# EAGLE design Busboard v10 (EAGLE 7.3.0)
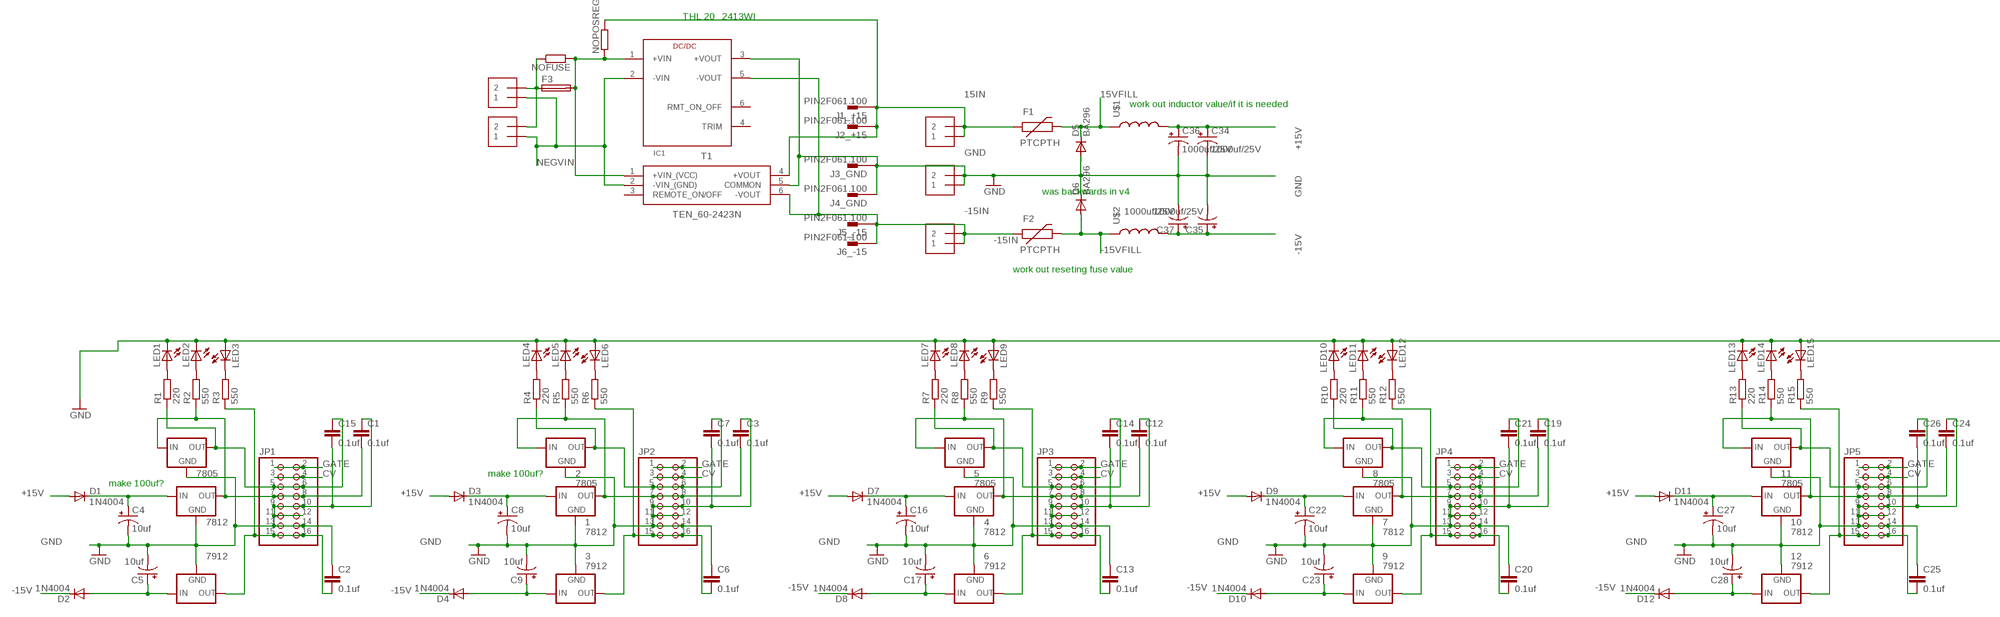
[diagram p0: schematic, sheet 1, part 1 of 2]
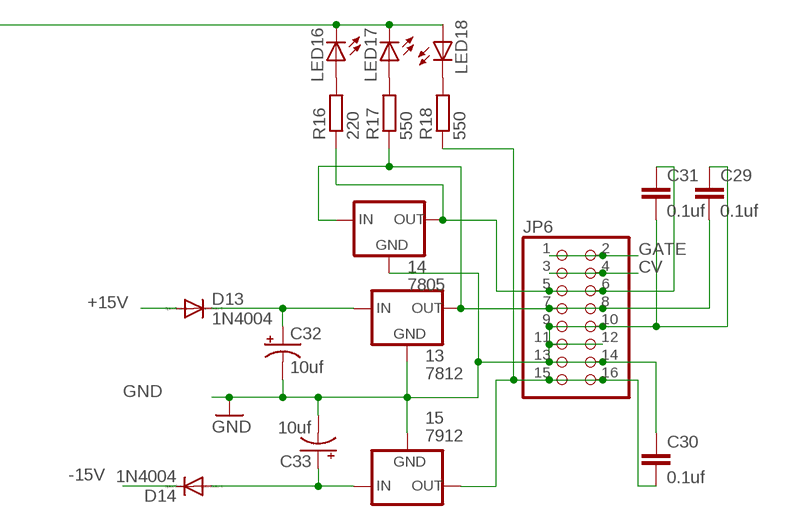
[diagram p1: schematic, sheet 1, part 2 of 2]

## Parts
1  7812  78MXXS  [78MXXS]
2  7805  78MXXS  [78MXXS]
3  7912  79XXS  [79XXS]
4  7812  78MXXS  [78MXXS]
5  7805  78MXXS  [78MXXS]
6  7912  79XXS  [79XXS]
7  7812  78MXXS  [78MXXS]
8  7805  78MXXS  [78MXXS]
9  7912  79XXS  [79XXS]
10  7812  78MXXS  [78MXXS]
11  7805  78MXXS  [78MXXS]
12  7912  79XXS  [79XXS]
13  7812  78MXXS  [78MXXS]
14  7805  78MXXS  [78MXXS]
15  7912  79XXS  [79XXS]
7805  78MXXS  [78MXXS]
7812  78MXXS  [78MXXS]
7912  79XXS  [79XXS]
+15V_DC_IN  1X2-3.5MM  [1X2-3.5MM]
-15V_DC_IN  1X2-3.5MM  [1X2-3.5MM]
C1  0.1uf  0.1UF-50V-20%(PTH)KIT-EZ  [CAP-PTH-SMALL-KIT]
C2  0.1uf  0.1UF-50V-20%(PTH)KIT-EZ  [CAP-PTH-SMALL-KIT]
C3  0.1uf  0.1UF-50V-20%(PTH)KIT-EZ  [CAP-PTH-SMALL-KIT]
C4  10uf  10UF-25V-20%(PTH)  [CPOL-RADIAL-10UF-25V]
C5  10uf  10UF-25V-20%(PTH)  [CPOL-RADIAL-10UF-25V]
C6  0.1uf  0.1UF-50V-20%(PTH)KIT-EZ  [CAP-PTH-SMALL-KIT]
C7  0.1uf  0.1UF-50V-20%(PTH)KIT-EZ  [CAP-PTH-SMALL-KIT]
C8  10uf  10UF-25V-20%(PTH)  [CPOL-RADIAL-10UF-25V]
C9  10uf  10UF-25V-20%(PTH)  [CPOL-RADIAL-10UF-25V]
C12  0.1uf  0.1UF-50V-20%(PTH)KIT-EZ  [CAP-PTH-SMALL-KIT]
C13  0.1uf  0.1UF-50V-20%(PTH)KIT-EZ  [CAP-PTH-SMALL-KIT]
C14  0.1uf  0.1UF-50V-20%(PTH)KIT-EZ  [CAP-PTH-SMALL-KIT]
C15  0.1uf  0.1UF-50V-20%(PTH)KIT-EZ  [CAP-PTH-SMALL-KIT]
C16  10uf  10UF-25V-20%(PTH)  [CPOL-RADIAL-10UF-25V]
C17  10uf  10UF-25V-20%(PTH)  [CPOL-RADIAL-10UF-25V]
C19  0.1uf  0.1UF-50V-20%(PTH)KIT-EZ  [CAP-PTH-SMALL-KIT]
C20  0.1uf  0.1UF-50V-20%(PTH)KIT-EZ  [CAP-PTH-SMALL-KIT]
C21  0.1uf  0.1UF-50V-20%(PTH)KIT-EZ  [CAP-PTH-SMALL-KIT]
C22  10uf  10UF-25V-20%(PTH)  [CPOL-RADIAL-10UF-25V]
C23  10uf  10UF-25V-20%(PTH)  [CPOL-RADIAL-10UF-25V]
C24  0.1uf  0.1UF-50V-20%(PTH)KIT-EZ  [CAP-PTH-SMALL-KIT]
C25  0.1uf  0.1UF-50V-20%(PTH)KIT-EZ  [CAP-PTH-SMALL-KIT]
C26  0.1uf  0.1UF-50V-20%(PTH)KIT-EZ  [CAP-PTH-SMALL-KIT]
C27  10uf  10UF-25V-20%(PTH)  [CPOL-RADIAL-10UF-25V]
C28  10uf  10UF-25V-20%(PTH)  [CPOL-RADIAL-10UF-25V]
C29  0.1uf  0.1UF-50V-20%(PTH)KIT-EZ  [CAP-PTH-SMALL-KIT]
C30  0.1uf  0.1UF-50V-20%(PTH)KIT-EZ  [CAP-PTH-SMALL-KIT]
C31  0.1uf  0.1UF-50V-20%(PTH)KIT-EZ  [CAP-PTH-SMALL-KIT]
C32  10uf  10UF-25V-20%(PTH)  [CPOL-RADIAL-10UF-25V]
C33  10uf  10UF-25V-20%(PTH)  [CPOL-RADIAL-10UF-25V]
C34  1000uf/25V  1000UF-25V(PTH)KIT  [CPOL-RADIAL-1000UF-25V-KIT]
C35  1000uf/25V  1000UF-25V(PTH)KIT  [CPOL-RADIAL-1000UF-25V-KIT]
C36  1000uf/25V  1000UF-25V(PTH)KIT  [CPOL-RADIAL-1000UF-25V-KIT]
C37  1000uf/25V  1000UF-25V(PTH)KIT  [CPOL-RADIAL-1000UF-25V-KIT]
D1  1N4004  [DO41-10]
D2  1N4004  [DO41-10]
D3  1N4004  [DO41-10]
D4  1N4004  [DO41-10]
D5  BA296  [P2-15]
D6  BA296  [P2-15]
D7  1N4004  [DO41-10]
D8  1N4004  [DO41-10]
D9  1N4004  [DO41-10]
D10  1N4004  [DO41-10]
D11  1N4004  [DO41-10]
D12  1N4004  [DO41-10]
D13  1N4004  [DO41-10]
D14  1N4004  [DO41-10]
DC_IN  1X2-3.5MM  [1X2-3.5MM]
DC_IO  1X2-3.5MM  [1X2-3.5MM]
F1  PTCPTH  [PTC]
F2  PTCPTH  [PTC]
F3  GSH15  [GSH15]
GND_IN  1X2-3.5MM  [1X2-3.5MM]
IC1  THL_20WI_SERIES  [THL_20WI_SERIES]
J1_+15  PIN2F061.100  [F061.100]
J2_+15  PIN2F061.100  [F061.100]
J3_GND  PIN2F061.100  [F061.100]
J4_GND  PIN2F061.100  [F061.100]
J5_-15  PIN2F061.100  [F061.100]
J6_-15  PIN2F061.100  [F061.100]
JP1  PINHD-2X8  [2X08]
JP2  PINHD-2X8  [2X08]
JP3  PINHD-2X8  [2X08]
JP4  PINHD-2X8  [2X08]
JP5  PINHD-2X8  [2X08]
JP6  PINHD-2X8  [2X08]
LED1  LED3MM  [LED3MM]
LED2  LED3MM  [LED3MM]
LED3  LED3MM  [LED3MM]
LED4  LED3MM  [LED3MM]
LED5  LED3MM  [LED3MM]
LED6  LED3MM  [LED3MM]
LED7  LED3MM  [LED3MM]
LED8  LED3MM  [LED3MM]
LED9  LED3MM  [LED3MM]
LED10  LED3MM  [LED3MM]
LED11  LED3MM  [LED3MM]
LED12  LED3MM  [LED3MM]
LED13  LED3MM  [LED3MM]
LED14  LED3MM  [LED3MM]
LED15  LED3MM  [LED3MM]
LED16  LED3MM  [LED3MM]
LED17  LED3MM  [LED3MM]
LED18  LED3MM  [LED3MM]
NOFUSE  SMT-REF  [SMT-REF]
NOPOSREG  SMT-REF  [SMT-REF]
R1  220  R-EU_0207/5V  [0207/5V]
R2  550  R-EU_0207/5V  [0207/5V]
R3  550  R-EU_0207/5V  [0207/5V]
R4  220  R-EU_0207/5V  [0207/5V]
R5  550  R-EU_0207/5V  [0207/5V]
R6  550  R-EU_0207/5V  [0207/5V]
R7  220  R-EU_0207/5V  [0207/5V]
R8  550  R-EU_0207/5V  [0207/5V]
R9  550  R-EU_0207/5V  [0207/5V]
R10  220  R-EU_0207/5V  [0207/5V]
R11  550  R-EU_0207/5V  [0207/5V]
R12  550  R-EU_0207/5V  [0207/5V]
R13  220  R-EU_0207/5V  [0207/5V]
R14  550  R-EU_0207/5V  [0207/5V]
R15  550  R-EU_0207/5V  [0207/5V]
R16  220  R-EU_0207/5V  [0207/5V]
R17  550  R-EU_0207/5V  [0207/5V]
R18  550  R-EU_0207/5V  [0207/5V]
T1  TEN_60-2423N  [TEN60-2423N]
U$1  INDUCTORRLB0912  [RLB0912]
U$2  INDUCTORRLB0912  [RLB0912]

## Nets
15IN: +15V_DC_IN.1 +15V_DC_IN.2 F1.P$1 J1_+15.A1 J1_+15.A2 J2_+15.A1 J2_+15.A2 NOPOSREG.1 T1.4(+VOUT)
15VFILL: D5.C F1.P$2 U$1.1
+15V: C34.+ C36.+ D1.A D3.A D7.A D9.A D11.A D13.A U$1.2
-15IN: -15V_DC_IN.1 -15V_DC_IN.2 F2.P$1 IC1.5(-VOUT) J5_-15.A1 J5_-15.A2 J6_-15.A1 J6_-15.A2 T1.6(-VOUT)
-15V: C35.+ C37.+ D2.C D4.C D8.C D10.C D12.C D14.C U$2.2
-15VFILL: D6.A F2.P$2 U$2.1
CV: JP1.3 JP1.4 JP2.3 JP2.4 JP3.3 JP3.4 JP4.3 JP4.4 JP5.3 JP5.4 JP6.3 JP6.4
GATE: JP1.1 JP1.2 JP2.1 JP2.2 JP3.1 JP3.2 JP4.1 JP4.2 JP5.1 JP5.2 JP6.1 JP6.2
GND: 1.GND 2.GND 3.GND 4.GND 5.GND 6.GND 7.GND 8.GND 9.GND 10.GND 11.GND 12.GND 13.GND 14.GND 15.GND 7805.GND 7812.GND 7912.GND C1.1 C2.1 C3.1 C4.2(-) C5.2(-) C6.1 C7.2 C8.2(-) C9.2(-) C12.1 C13.1 C14.2 C15.2 C16.2(-) C17.2(-) C19.1 C20.1 C21.2 C22.2(-) C23.2(-) C24.1 C25.1 C26.2 C27.2(-) C28.2(-) C29.1 C30.1 C31.2 C32.2(-) C33.2(-) C34.- C35.- C36.- C37.- D5.A D6.C GND_IN.1 GND_IN.2 IC1.3(+VOUT) J3_GND.A1 J3_GND.A2 J4_GND.A1 J4_GND.A2 JP1.9 JP1.10 JP1.11 JP1.12 JP1.13 JP1.14 JP2.9 JP2.10 JP2.11 JP2.12 JP2.13 JP2.14 JP3.9 JP3.10 JP3.11 JP3.12 JP3.13 JP3.14 JP4.9 JP4.10 JP4.11 JP4.12 JP4.13 JP4.14 JP5.9 JP5.10 JP5.11 JP5.12 JP5.13 JP5.14 JP6.9 JP6.10 JP6.11 JP6.12 JP6.13 JP6.14 LED1.K(C) LED2.K(C) LED3.A LED4.K(C) LED5.K(C) LED6.A LED7.K(C) LED8.K(C) LED9.A LED10.K(C) LED11.K(C) LED12.A LED13.K(C) LED14.K(C) LED15.A LED16.K(C) LED17.K(C) LED18.A T1.5(COMMON)
N$1: 7912.IN C5.1(+) D2.A
N$2: 7912.OUT C2.2 JP1.15 JP1.16 R3.1
N$3: 6.OUT C13.2 JP3.15 JP3.16 R9.1
N$4: 7812.IN C4.1(+) D1.C
N$5: 7805.IN 7812.OUT C1.2 JP1.7 JP1.8 R2.1
N$6: 3.OUT C6.2 JP2.15 JP2.16 R6.1
N$7: 6.IN C17.1(+) D8.A
N$8: 3.IN C9.1(+) D4.A
N$9: 1.IN C8.1(+) D3.C
N$10: F3.2 IC1.1(+VIN) NOFUSE.2 NOPOSREG.2 T1.1(+VIN_(VCC))
N$11: DC_IN.2 DC_IO.2 F3.1 NOFUSE.1
N$12: LED1.A R1.2
N$14: LED2.A R2.2
N$17: LED3.K(C) R3.2
N$18: 1.OUT 2.IN C3.2 JP2.7 JP2.8 R5.1
N$19: 4.IN C16.1(+) D7.C
N$20: 2.OUT C7.1 JP2.5 JP2.6 R4.1
N$21: 7805.OUT C15.1 JP1.5 JP1.6 R1.1
N$23: LED4.A R4.2
N$24: LED5.A R5.2
N$25: LED6.K(C) R6.2
N$26: 4.OUT 5.IN C12.2 JP3.7 JP3.8 R8.1
N$27: 5.OUT C14.1 JP3.5 JP3.6 R7.1
N$28: LED7.A R7.2
N$29: LED8.A R8.2
N$30: LED9.K(C) R9.2
N$47: 9.OUT C20.2 JP4.15 JP4.16 R12.1
N$48: 9.IN C23.1(+) D10.A
N$49: 7.IN C22.1(+) D9.C
N$50: 7.OUT 8.IN C19.2 JP4.7 JP4.8 R11.1
N$51: 8.OUT C21.1 JP4.5 JP4.6 R10.1
N$52: LED10.A R10.2
N$53: LED11.A R11.2
N$54: LED12.K(C) R12.2
N$55: 15.OUT C30.2 JP6.15 JP6.16 R18.1
N$56: 12.OUT C25.2 JP5.15 JP5.16 R15.1
N$57: 12.IN C28.1(+) D12.A
N$58: 10.IN C27.1(+) D11.C
N$59: 10.OUT 11.IN C24.2 JP5.7 JP5.8 R14.1
N$60: 11.OUT C26.1 JP5.5 JP5.6 R13.1
N$61: LED13.A R13.2
N$62: LED14.A R14.2
N$63: LED15.K(C) R15.2
N$64: 15.IN C33.1(+) D14.A
N$65: 13.IN C32.1(+) D13.C
N$66: 13.OUT 14.IN C29.2 JP6.7 JP6.8 R17.1
N$67: 14.OUT C31.1 JP6.5 JP6.6 R16.1
N$68: LED16.A R16.2
N$69: LED17.A R17.2
N$70: LED18.K(C) R18.2
NEGVIN: DC_IN.1 DC_IO.1 IC1.2(-VIN) T1.2(-VIN_(GND))
Unconnected: IC1.4(TRIM) IC1.6(RMT_ON_OFF) T1.3(REMOTE_ON/OFF)

## Notes on the sheet
- THL 20‑2413WI
- work out inductor value/if it is needed
- was backwards in v4
- work out reseting fuse value
- make 100uf?
- make 100uf?

## Library data of the parts
1 2 4 5 7 8 10 11 13 14 7805 7812 = v-reg:78MXXS: VOLTAGE REGULATOR
3 6 9 12 15 7912 = v-reg:79XXS: VOLTAGE REGULATOR
+15V_DC_IN -15V_DC_IN DC_IN DC_IO GND_IN = adafruit:1X2: 3.5mm Terminal block http://www.ladyada.net/library/pcb/eaglelibrary.html
C1-C3 C6 C7 C12-C15 C19-C21 C24-C26 C29-C31 = SparkFun-Capacitors:0.1UF-50V-20%(PTH): CAP-08370; PROD_ID: CAP-08370
C4 C5 C8 C9 C16 C17 C22 C23 C27 C28 C32 C33 = SparkFun-Capacitors:10UF-25V-20%(PTH): CAP-08440; PROD_ID: CAP-08440
C34-C37 = SparkFun-Capacitors:1000UF-25V(PTH): CAP-08070; PROD_ID: CAP-09538
D1-D4 D7-D14 = diode:1N4004: DIODE general purpose rectifier, 1 A
D5 D6 = diode:BA296: DIODE
F1 F2 = SparkFun-PowerIC:PTC: Resettable Fuse PTC Resettable Fuse. Spark Fun Electronics SKU : COM-08357
F3 = fuse:GSH15: FUSE HOLDER grid 15mm, 19649 Wickmann; MPN: 64900001039; OC_FARNELL: 1271673; OC_NEWARK: 02P0318
IC1 = traco_thl_tel_series:THL_20WI_SERIES: TRACO POWER DC/DC converter THL 20WI Series created by Mario Blunk - electronics & IT engineering at www.train-z.de; HEAT-SINK: NO
J1_+15 J2_+15 J3_GND J4_GND J5_-15 J6_-15 = con-faston:PIN2: Flachstecker Typ Tyco/Electronics/AMP TAB, FASTON Printed Circuit Board Tabs Source: http://www.buerklin.com, http://catalog.tycoelectronics.com; OC_FARNELL: unknown; OC_NEWARK: unknown
JP1-JP6 = pinhead:PINHD-2X8: PIN HEADER
LED1-LED18 = led:LED: LED OSRAM: - CHIPLED LG R971, LG N971, LY N971, LG Q971, LY Q971, LO R971, LY R971 LH N974, LH R974 LS Q976, LO Q976, LY Q976 LO Q996 - Hyper CHIPLED LW Q18S LB Q993, LB Q99A, LB R99A - SideLED LS A670, LO A670, LY A670, LG A670, LP A670 LB A673, LV A673, LT A673, LW A673 LH A674 LY A675 LS A676, LA A676, LO A676, LY A676, LW A676 LS A679, LY A679, LG A679 - Hyper Micro SIDELED® LS Y876, LA Y876, LO Y876, LY Y876 LT Y87S - SmartLED LW L88C, LW L88S LB L89C, LB L89S, LG L890 LS L89K, LO L89K, LY L89K LS L896, LA L896, LO L896, LY L896 - TOPLED LS T670, LO T670, LY T670, LG T670, LP T670 LSG T670, LSP T670, LSY T670, LOP T670, LYG T670 LG T671, LOG T671, LSG T671 LB T673, LV T673, LT T673, LW T673 LH T674 LS T676, LA T676, LO T676, LY T676, LB T676, LH T676, LSB T676, LW T676 LB T67C, LV T67C, LT T67C, LS T67K, LO T67K, LY T67K, LW E67C LS E67B, LA E67B, LO E67B, LY E67B, LB E67C, LV E67C, LT E67C LW T67C LS T679, LY T679, LG T679 LS T770, LO T770, LY T770, LG T770, LP T770 LB T773, LV T773, LT T773, LW T773 LH T774 LS E675, LA E675, LY E675, LS T675 LS T776, LA T776, LO T776, LY T776, LB T776 LHGB T686 LT T68C, LB T68C - Hyper Mini TOPLED® LB M676 - Mini TOPLED Santana® LG M470 LS M47K, LO M47K, LY M47K Source: http://www.osram.convergy.de LUXEON: - LUMILED® LXK2-PW12-R00, LXK2-PW12-S00, LXK2-PW14-U00, LXK2-PW14-V00 LXK2-PM12-R00, LXK2-PM12-S00, LXK2-PM14-U00 LXK2-PE12-Q00, LXK2-PE12-R00, LXK2-PE12-S00, LXK2-PE14-T00, LXK2-PE14-U00 LXK2-PB12-K00, LXK2-PB12-L00, LXK2-PB12-M00, LXK2-PB14-N00, LXK2-PB14-P00, LXK2-PB14-Q00 LXK2-PR12-L00, LXK2-PR12-M00, LXK2-PR14-Q00, LXK2-PR14-R00 LXK2-PD12-Q00, LXK2-PD12-R00, LXK2-PD12-S00 LXK2-PH12-R00, LXK2-PH12-S00 LXK2-PL12-P00, LXK2-PL12-Q00, LXK2-PL12-R00 Source: www.luxeon.com KINGBRIGHT: KA-3528ASYC Source: www.kingbright.com
NOFUSE NOPOSREG = resistor-shunt:SMT-REF: SMD SHUNT RESISTOR; OC_FARNELL: unknown; OC_NEWARK: unknown
R1-R18 = resistor:R-EU_: RESISTOR, European symbol
T1 = TEN_60-2423N:TEN_60-2423N: TRACOPOWER 60W Isolated DC-DC Converter, Vin 18 36 V dc, Vout 15V dc, I/O isolation 1500V dc <https://componentsearchengine.com/Images/3/760517.jpg> Source: Datasheet <http://assets.tracopower.com/20161031120609/TEN60N/documents/ten60n-datasheet.pdf>; DESCRIPTION: TRACOPOWER 60W Isolated DC-DC Converter, Vin 18 36 V dc, Vout 15V dc, I/O isolation 1500V dc; HEIGHT: mm; MANUFACTURER_NAME: Traco Power; MANUFACTURER_PART_NUMBER: TEN 60-2423N; RS_PART_NUMBER: 7882705; SUPPLIER_NAME: RS
U$1 U$2 = SparkFun-Passives:INDUCTOR: Inductors Basic Inductor/Choke - 0603 and 1206. Footprints are not proven and vary greatly between part numbers. SRN6045- 33uH, 20% 1.4A SDR0403-560KL - 56uH, 10%, 500mA RMS/740mA peak

## Board
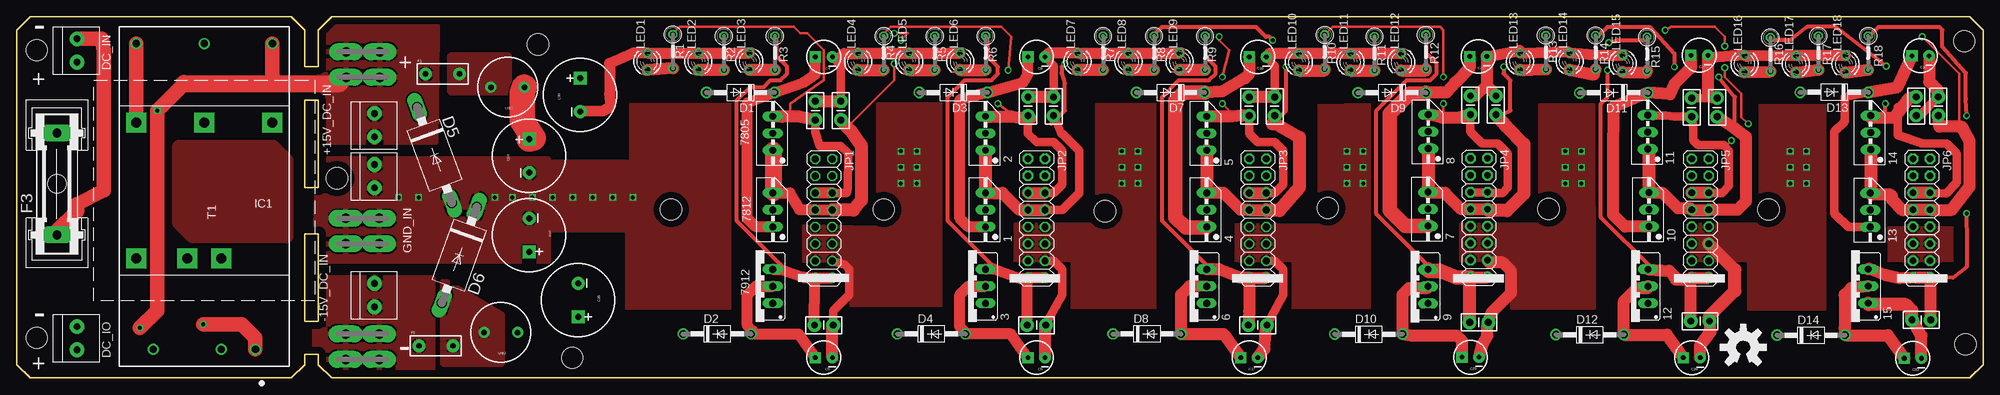
[diagram p2: board, top side]
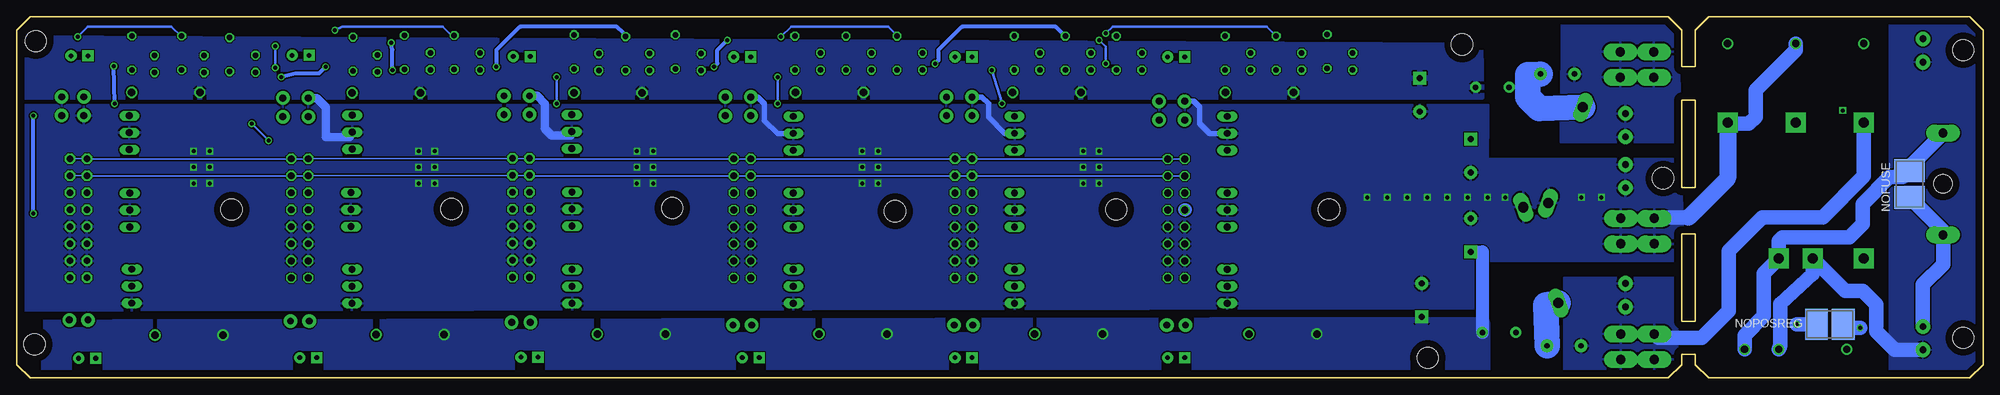
[diagram p3: board, bottom side, seen from below]

Size 293.6 x 54 mm. Coordinates in mm from the lower left corner, seen from the top.
Outline: 293.6,2 293.6,52 291.6,54 47,54 45,52 45,46.5 43,46.5 43,52 41,54 2,54 0,52 0,2 2,0 41,0 43,2 43,3.5 45,3.5 45,2 47,0 291.6,0 293.6,2
Outline: 43,8.5 45,8.5 45,21.5 43,21.5 43,8.5
Outline: 43,41.5 45,41.5 45,28.5 43,28.5 43,41.5
Copper layers (1*16): Top 0.035mm / dielectric 1.5mm / Bottom 0.035mm
Design rules "default": minimum track width 10mil, minimum drill 24mil, track to track 8mil, track to pad 8mil, pad to pad 8mil, via to via 8mil, smd to smd 8mil, copper to edge 40mil, drill to drill 8mil, minimum pad ring 10mil, minimum via ring 8mil, stop-mask expansion 4mil, vias tented up to drill 0mil, thermal gap 10mil
Holes 3.2 mm at 162.47,24.92 195.72,25.42 82.94,3 77.81,49.84 290.75,50.34 290.95,5.04 228.7,25.24 129.45,25.17 261.53,25.17 97.69,25.17 3,6 3,49 47.81,29.84

### Footprints (pad centres in the part's own frame; a part is rotated, then mirrored left to right if it is on the bottom)
78MXXS = drill 1.016 long: GND 0,-2.54; IN -2.54,-2.54; OUT 2.54,-2.54
79XXS = drill 1.016 long: GND -2.54,-2.54; IN 0,-2.54; OUT 2.54,-2.54
1X2-3.5MM = drill 1 pad 2.184: 1 1.8,0; 2 -1.7,0
CAP-PTH-SMALL-KIT = drill 1.016 pad 2.032: 1 -1.397,0; 2 1.397,0
CPOL-RADIAL-10UF-25V = drill 0.7 pad 1.651 square: 1 1.27,0 | drill 0.7 pad 1.651: 2 -1.27,0
CPOL-RADIAL-1000UF-25V-KIT = drill 0.9 pad 1.93 square: + 2.5,0 | drill 0.9 pad 1.93: - -2.5,0
DO41-10 = drill 1.118: A 5.08,0; C -5.08,0
P2-15 = drill 1.499 long: A 7.62,0; C -7.62,0
PTC = drill 0.8 pad 1.88: P$1 -2.54,0; P$2 2.54,0
GSH15 = drill 1.321 pad 2.54 long: 1 -7.62,0; 2 7.62,0 | hole 2.794: 0,0
THL_20WI_SERIES = drill 1.5 pad 3 square: 1 -2.54,10.16; 2 2.54,10.16; 3 -10.16,-10.16; 4 0,-10.16; 5 10.16,-10.16; 6 10.16,10.16
F061.100 = drill 1.4 pad 2.54 long: A1 -2.5,0; A2 2.5,0
2X08 = drill 1.016 octagon: 1 -8.89,-1.27; 2 -8.89,1.27; 3 -6.35,-1.27; 4 -6.35,1.27; 5 -3.81,-1.27; 6 -3.81,1.27; 7 -1.27,-1.27; 8 -1.27,1.27; 9 1.27,-1.27; 10 1.27,1.27; 11 3.81,-1.27; 12 3.81,1.27; 13 6.35,-1.27; 14 6.35,1.27; 15 8.89,-1.27; 16 8.89,1.27
LED3MM = drill 0.813 octagon: A -1.27,0; K 1.27,0
SMT-REF = smd 3.4 x 4.6: 1 2.007,0; 2 -2.007,0
0207/5V = drill 0.813 octagon: 1 -2.54,0; 2 2.54,0
TEN60-2423N = drill 1.1 pad 1.65: 1 -45.72,-7.62; 2 -45.72,-2.54; 3 -45.72,7.62; 4 0,-10.16; 5 0,0; 6 0,10.16
RLB0912 = drill 0.813 pad 1.651: 1 2.502,0; 2 -2.502,0

### Placement (x,y rotation side)
1  142.09,25.13 90 top
2  142.09,36.56 90 top
3  142.09,13.7 90 top
4  175.11,25.13 90 top
5  175.11,36.56 90 top
6  175.11,13.7 90 top
7  208.15,25.26 90 top
8  208.2,36.82 90 top
9  208.15,13.67 90 top
10  241.17,25.18 90 top
11  240.97,36.75 90 top
12  241.02,13.7 90 top
13  274.19,25.1 90 top
14  274.24,36.67 90 top
15  273.88,13.72 90 top
7805  110.34,36.56 90 top
7812  110.34,25.13 90 top
7912  110.34,13.7 90 top
+15V_DC_IN  53.43,37.83 270 top
-15V_DC_IN  53.43,12.43 270 top
C1  123.04,39.97 270 top
C2  120.5,7.89 180 top
C3  154.79,40.6 270 top
C4  120.5,47.99 180 top
C5  120.5,3.04 180 top
C6  152.25,7.89 180 top
C7  150.98,40.6 90 top
C8  152.25,47.99 180 top
C9  152.25,3.04 180 top
C12  187.81,40.6 270 top
C13  185.27,7.89 180 top
C14  184,40.6 90 top
C15  119.23,39.97 90 top
C16  185.27,47.99 180 top
C17  184,3.04 180 top
C19  220.85,40.77 270 top
C20  218.31,8.31 180 top
C21  217.04,40.78 90 top
C22  218.19,48.06 180 top
C23  217.05,3.11 180 top
C24  253.87,40.45 270 top
C25  251.33,8.49 180 top
C26  250.06,40.45 90 top
C27  251.21,48.23 180 top
C28  250.07,3.03 180 top
C29  286.89,40.62 270 top
C30  284.35,8.67 0 top
C31  283.59,40.62 270 top
C32  284.23,48.16 180 top
C33  283.09,2.95 180 top
C34  76.51,33.19 90 top
C35  83.81,11.61 270 top
C36  84.11,42.33 90 top
C37  76.51,21.36 270 top
D1  108.07,42.68 180 top
D2  104.57,6.58 0 top
D3  139.82,42.68 180 top
D4  136.55,6.58 0 top
D5  62.37,33.3 290 top
D6  66.07,18.36 250 top
D7  172.26,42.68 180 top
D8  168.76,6.58 0 top
D9  205.31,42.65 180 top
D10  201.84,6.55 0 top
D11  238.43,42.62 180 top
D12  234.86,6.47 0 top
D13  271.35,42.7 180 top
D14  267.88,6.39 0 top
DC_IN  9,49 270 top
DC_IO  9,6 270 top
F1  63.59,45.45 0 top
F2  62.59,4.81 0 top
F3  6,29 90 top
GND_IN  53.43,30.21 270 top
IC1  28,28 180 top
J1_+15  51.69,48.76 180 top
J2_+15  51.69,44.95 180 top
J3_GND  51.62,23.86 180 top
J4_GND  51.62,20.05 180 top
J5_-15  51.62,6.58 180 top
J6_-15  51.62,2.77 180 top
JP1  120.5,23.86 270 top
JP2  152.25,23.86 270 top
JP3  185.27,23.86 270 top
JP4  218.31,23.94 270 top
JP5  251.33,23.87 270 top
JP6  284.39,23.88 270 top
LED1  94.14,47.3 90 top
LED2  101.76,47.3 90 top
LED3  109.38,47.3 270 top
LED4  125.62,47.3 90 top
LED5  133.24,47.3 90 top
LED6  140.86,47.3 270 top
LED7  158.37,47.3 90 top
LED8  165.99,47.3 90 top
LED9  173.61,47.3 270 top
LED10  191.42,47.22 90 top
LED11  199.12,47.22 90 top
LED12  206.7,47.22 270 top
LED13  224.44,47.3 90 top
LED14  231.85,47.35 90 top
LED15  239.76,47 270 top
LED16  257.96,46.97 90 top
LED17  265.62,46.92 90 top
LED18  273.02,46.92 270 top
NOFUSE  11,29 270 bottom
NOPOSREG  22.9,8 0 bottom
R1  97.95,48.82 270 top
R2  105.57,48.57 270 top
R3  113.19,48.57 270 top
R4  129.43,48.57 270 top
R5  137.05,48.57 270 top
R6  144.67,48.57 270 top
R7  162.18,48.57 270 top
R8  169.8,48.57 270 top
R9  177.42,48.57 270 top
R10  195.27,48.75 270 top
R11  202.7,48.49 270 top
R12  210.38,48.75 270 top
R13  228.29,48.67 270 top
R14  235.72,48.67 270 top
R15  243.4,48.42 270 top
R16  261.81,48.34 270 top
R17  268.99,48.59 270 top
R18  276.42,48.59 270 top
T1  28,50 90 top
U$1  73.29,43.45 180 top
U$2  72.29,6.81 180 top
U$3  [OSHW-LOGO-L]  257.76,4.58 0 top

### Tracks (layer width: path | path; a pad name or v marks a point on that pad's centre or on a via)
15IN  (via drill 0.6)
  Top 2.184: 25,44 v20.99,39.99 20.99,9.99 v18.4,7.5 | 48.24,44 J2_+15.A2 | T1.4 38.16,44.84 39,44
  Top 2.54: 25,44 39,44 48.24,44
  Bottom 2.184: v18.4,7.5 20.49,7.5 NOPOSREG.1
  pour Bottom: 44.92,35.29 63.09,35.29 62.84,56.8 45.92,56.3
  pour Top: 45.19,35.29 62.59,35.29 62.84,56.8 45.19,56.55
15VFILL
  Bottom 3.81: D5.C 66.26,40.26 68,42 68,45.32 F1.P$2
  pour Top (no thermals): 64.86,47.99 73.29,47.99 73.29,42.91 64.86,42.91
+15V
  Top 3.81: C34.+ 77.11,35.89 75.5,38.5 75.5,42.66 U$1.2
  pour Bottom: 74.87,42.01 355.98,41.94 324.72,51.04 75.02,49.76
-15IN
  Top 2.184: T1.6 IC1.5
  Bottom 2.184: IC1.5 17.84,30.16 24,24 33,24 38,19 38,10 42,6 48.54,6 J5_-15.A2
  pour Top: 44.46,14.97 62.09,14.97 62.09,-0.27 44.46,-0.27
  pour Bottom: 45.65,14.97 62.59,14.97 62.59,-0.77 45.65,-0.27
-15V
  Bottom 1.93: C37.+ 74.79,18.86 U$2.2
  pour Bottom: 319.64,-2.81 320.39,7.83 74.52,8.35 74.52,-3.81
-15VFILL
  Bottom 3.81: F2.P$2 65.33,10.93 D6.A
  pour Top: 63.86,2.27 63.86,14.35 72.29,9.35 72.29,2.27
CV
  Bottom 0.254: JP1.3 JP1.4 JP2.3 JP2.4 JP3.3 JP3.4 216.96,30.21 JP4.3 JP4.4 249.98,30.3 JP5.3 JP5.4 283.11,30.22 JP6.3 JP6.4
GATE
  Bottom 0.254: JP1.1 JP1.2 JP2.1 JP2.2 JP3.1 JP3.2 216.96,32.75 JP4.1 JP4.2 249.98,32.84 JP5.1 JP5.2 283.11,32.76 JP6.1 JP6.2
GND  (via drill 0.6)
  Top 1.27: C13.1 186.67,8.02 189.08,12.43 189.08,16.24 187.81,17.51 JP3.14 | C6.1 153.65,8.02 156.06,12.43 156.06,16.24 154.79,17.51 JP2.14 | C2.1 121.9,10.02 124.31,12.43 124.31,16.24 123.67,16.88 JP1.14 | C12.1 187.81,46.72 C16.2 | C3.1 154.79,46.72 C8.2 | C1.1 123.04,46.72 C4.2 | C26.2 C24.1 | C31.2 284.1,39.23 C29.1
  Top 1.676: C36.- 87.58,39.9 88.6,40.5 88.5,42.5 88.5,47 92.07,48.57 LED1.K LED2.K LED3.A | 123.04,46.72 123.04,48.04 123.5,48.5 125.55,48.5 LED4.K LED5.K LED6.A | C8.2 154.1,48.57 LED7.K LED8.K LED9.A | LED12.A LED11.K LED10.K 187.04,48.49 C16.2 | C22.2 224.33,48.95 LED13.K 231.59,48.77 LED14.K 236.5,48.22 LED15.A | LED18.A LED17.K 258.22,48.09 LED16.K 252.88,47.84 C27.2 | C21.2 217.83,42.17 219.46,43.81
  Top 1.778: C5.2 121.77,7.76 C2.1 | C9.2 153.52,7.76 C6.1 | C12.1 C14.2 | C3.1 C7.2 | C15.2 C1.1 | C17.2 186.27,4.31 186.54,7.58 186.54,7.76 C13.1 | C23.2 218.86,5.11 219.58,6.32 219.58,7.94 C20.1 220.25,9.81 223.12,12.68 223.12,15.99 221.85,17.26 219.92,17.26 JP4.14 | C22.2 219.46,43.81 C19.1 | C28.2 251.34,4.84 252.84,6.84 252.84,8.38 C25.1 | C27.2 252.48,42.24 C24.1 | C33.2 284.36,6.32 283.06,8.62 283.06,8.56 C30.1 | C32.2 285.5,44.28 286.62,43.16 286.62,43.3 C29.1
  Top 1.93: C30.1 282.95,10.05 282,11 276.44,11 15.GND | C25.1 252.73,9.23 256.5,13 256.5,16.16 JP5.12
  Bottom 0.813: C14.2 183,42 182,41 182,38.5 180,36.5 177.71,36.5 5.GND | 2.GND 146.06,36.56 148.5,39 148.5,41 149.5,42 C7.2 | C15.2 117.86,41.36 117,40.5 117,38 115.5,36.5 112.94,36.5 7805.GND
  Bottom 1.27: C26.2 248.84,41.84 247.5,40.5 247.5,36 243.86,36 11.GND | C21.2 215.93,42.17 214.75,41 214.75,37.25 213.75,36.25 210.92,36.25 8.GND
  Bottom 2.184: T1.5 28,49 34,43 34,39 35,38 38,38 IC1.3 | 44,24 48.98,24 J3_GND.A2
  Bottom 2.54: IC1.3 38.16,29.84 44,24
  other vias: 89,27 92,27 132,31.5 134.4,31.5 132,33.9 134.4,33.9 134.4,29.1 132,29.1 165,33.9 167.4,33.9 165,31.5 165,29.1 167.4,31.5 167.4,29.1 198.6,33.9 201,33.9 198.6,31.5 201,31.5 198.6,29.1 201,29.1 231.2,33.9 231.2,31.5 231.2,29.1 233.6,33.9 233.6,31.5 233.6,29.1 264.8,33.9 264.8,31.5 264.8,29.1 267.2,33.9 267.2,31.5 267.2,29.1 86,27 83,27 80,27 77,27 74,27 71.4,27 60,27 57,27
  pour Bottom: 44.73,17.51 81.13,17.51 81.13,32.75 45.19,32.75
  pour Top: 44.92,32.75 79.36,32.75 79.36,17.51 44.46,17.51
  pour Bottom: 74.13,10.39 326.24,10.02 323.73,40.75 73.87,40.76
  pour Top: 279.5,17.5 289,17.5 289,22.5 279.5,22.5
  pour Top: 250,17.5 258.5,17.5 258.5,10.25 270,10.25 270,40.8 260.2,40.8 260.2,23 250,23
  pour Top: 215.5,17.5 223,17.5 223.1,10.4 235.6,10.4 235.5,40.85 227.3,40.85 227.3,23 215.5,23
  pour Top: 182,17.5 190.5,17.5 190.5,10.5 202,10.5 202,40.9 194.4,40.8 194.4,22.9 182,23
  pour Top: 149,17.5 157.5,17.5 157.5,10.5 170,10.5 170,41 161.2,40.9 161.2,23.4 160,23 149,23
  pour Top: 117.44,17.34 124.5,17.47 124.5,10.8 138,10.8 138,41 128.5,41 128.5,22.58 117.44,22.77
  pour Top: 79,22 91,21.9 91,10.3 106.5,10.4 106.5,41 91.6,40.9 91.6,32.4 79,32.5
N$1
  Top 1.676: C5.1 116.69,6.58 D2.A 109.84,7.08 109.07,7.85 109.07,12.43 110.34,13.7 7912.IN
N$2
  Top 0.61: R3.1 113.5,51 113.5,48 115,46.5 115,45.5 114,44.5 112.5,44.5 111.5,43.5 109.5,43.5 107.5,41.5 107.5,23.5 114,17 114,16.24
  Top 1.676: 7912.OUT 114,16.24 114.06,16.24 117.51,15.05 JP1.15 | JP1.15 JP1.16 | C2.2 119.17,14.47 JP1.15
N$3
  Top 0.61: R9.1 177.5,51 177.5,48 179,46.5 179,45.5 178,44.5 173.5,44.5 171,42 171,23.5 177.5,17 6.OUT
  Top 1.778: JP3.15 JP3.16 | JP3.15 182.73,14.97 179.46,16.24 6.OUT | JP3.15 184,10.02 C13.2
N$4
  Top 1.676: C4.1 119.23,45.45 117.46,44.18 D1.C 109.07,41.1 109.07,23.86 110.34,22.59 7812.IN
N$5  (via drill 0.6)
  Top 0.406: v131,51.5 133,51.5 v132,50.5 | v131,47 131,44.5 124.5,38 124.43,37.07
  Top 1.676: 7812.OUT 113,27.67 115.42,27.67 116.88,25.16 | 116.88,25.16 JP1.8 | 116.88,25.16 119.19,25.16 JP1.7
  Top 1.93: C1.2 124.43,37.07 126.1,34.7 126.1,26.6 124.91,25.08 121.86,25.09 JP1.8
  Top 2.54: 113,27.67 113,34 7805.IN
  Bottom 0.406: v131,51.5 130,52.5 107,52.5 106,51.5 R2.1 | v132,50.5 131,49.5 v131,47
  Bottom 1.676: 119.1,25.16 119.39,25.16 119.4,25.16
  Bottom 1.93: JP1.7 119.1,25.12 119.1,25.16
N$6
  Top 0.61: R6.1 145,51 145,48 146.5,46.5 146.5,45.5 145.5,44.5 141.5,44.5 139,42 139,23.5 145.5,17 3.OUT
  Top 1.676: C6.2 150.85,14.84 | 150.85,14.84 JP2.15 JP2.16 | 150.85,14.84 149.84,14.84 145.94,16.24 3.OUT
N$7
  Top 1.676: 6.IN 175.11,13.7
  Top 1.778: C17.1 180.19,6.58 D8.A 173.84,12.43 175.11,13.7
N$8
  Top 1.676: C9.1 148.44,6.58 141.86,6.58 | D4.A 141.86,6.58 | 141.86,6.58 140.82,7.62 140.82,12.43 142.09,13.7 3.IN
N$9
  Top 1.676: 1.IN 142.09,22.59 140.82,23.86 140.82,41.6 D3.C 150.21,44.18 150.98,45.45 C8.1
N$10  (via drill 0.6)
  Top 2.184: v27.85,8 33.62,8 35.62,6 T1.1
  Bottom 2.184: F3.2 11,31.62 NOFUSE.2 12.01,30 14,30 18,26 18,23 20,21 30,21 30.54,20.46 IC1.1 32.75,15.63 32.75,9.25 35.62,6.38 T1.1 | NOPOSREG.2 v27.85,8
N$11
  Top 2.184: DC_IN.2 12.7,50.7 13,49 13,28 9,26 9,24.99 6,21.99 F3.1
  Bottom 2.184: DC_IO.2 9,14 6,17 F3.1 6,21.99 NOFUSE.1
N$12
  Top 1.778: R1.2 LED1.A
N$13
  pour Top: 24.25,34.5 38.25,34.5 40.25,32.5 40.25,21.25 26.25,21.25 24.25,23.25
N$14
  Top 1.778: R2.2 LED2.A
N$17
  Top 1.778: R3.2 LED3.K
N$18  (via drill 0.6)
  Top 0.61: v156.5,47 156,46.5 156,45.5 156.5,44 156.5,40 154.5,38 C3.2
  Top 1.27: JP2.8 156.06,25.13 158.6,27.67 158.6,34.02 156.06,36.56 155.93,36.56 C3.2
  Top 1.778: JP2.8 JP2.7 149.71,25.13 147.17,27.67 1.OUT
  Top 1.93: 2.IN 1.OUT
  Bottom 0.61: v156.5,47 156,47.5 156,49 152.5,52.5 138.5,52.5 137.5,51.5 R5.1
N$19
  Top 1.778: C16.1 184,45.45 183.37,44.81 179.97,42.81 D7.C
  Top 2.184: D7.C 174.18,42.68 173,41.5 173,24 174.5,22.5 177.56,22.5 4.IN
N$20  (via drill 0.6)
  Top 0.406: v148,46 148.5,51 147,52.5 130.5,52.5 129.5,51.5 R4.1 | v146.5,41 148.5,39.5 148.44,39.1
  Top 1.27: C7.1 150.98,36.56 152.25,35.29 154.79,35.29 156.06,34.02 156.06,28.94 154.79,27.67 JP2.6
  Top 1.778: JP2.5 JP2.6 | 2.OUT 148.44,39.1 150.71,38.83 151.35,38.83 C7.1
  Bottom 0.406: v146.5,41 v148,46
N$21
  Top 0.406: 115.5,39.1 115.5,41 120.5,44.5 120.5,49 118,51.5 117,51.5 116,52.5 99,52.5 98,51.5 R1.1
  Top 1.27: C15.1 119.23,36.79 119.87,34.66 123.04,34.66 124.11,33.59 124.07,28.21 123.94,27.66 JP1.6
  Top 1.676: JP1.6 JP1.5 | 114.28,38.97 7805.OUT
  Top 1.778: C15.1 116.69,39.1 115.5,39.1 7805.OUT
N$23
  Top 1.778: LED4.A R4.2
N$24
  Top 1.778: LED5.A R5.2
N$25
  Top 1.778: LED6.K R6.2
N$26  (via drill 0.6)
  Top 0.61: R8.1 170,51.5 171,52.5 185,52.5 186.5,51 187,51 v187.5,50.5 | v189.5,46.5 189.5,40 187.5,38 C12.2
  Top 1.778: JP3.8 JP3.7 182.73,25.13 180.19,27.67 4.OUT
  Top 1.93: 187.5,38 188,38 191.5,36 191.5,28.5 188.5,25 186.67,25 JP3.8 | 5.IN 4.OUT
  Bottom 0.61: v187.5,50.5 189,49 189,47 v189.5,46.5
N$27  (via drill 0.6)
  Top 0.406: v180,45 181,49 179.5,50.5 v179.5,51 | v180,41 181.5,39.5 181.46,39.1
  Top 1.27: C14.1 184,36.56 185.27,35.29 187.81,35.29 189.08,34.02 189.08,28.94 187.81,27.67 JP3.6
  Top 1.778: JP3.5 JP3.6 | C14.1 182.86,39.2 181.46,39.1 5.OUT
  Bottom 0.406: v180,41 v180,45 | v179.5,51 178,52.5 163.5,52.5 162.5,51.5 R7.1
N$28
  Top 1.778: R7.2 LED7.A
N$29
  Top 1.778: R8.2 LED8.A
N$30
  Top 1.778: R9.2 LED9.K
N$47
  Top 0.61: R12.1 210.5,51 210.5,48.5 212,47 212,45.5 211,44.5 207.5,44.5 203,40 203,24.5 210.5,17 9.OUT
  Top 1.778: JP4.15 JP4.16
  Top 1.93: C20.2 216.91,14.93 JP4.15
  Top 2.184: JP4.15 214.94,15.05 212.5,16 210.8,16 9.OUT
N$48
  Top 1.778: 9.IN 210.56,13.45 207.88,13.45 206.92,12.49 D10.A 208.15,6.31 214.99,6.31 215.78,5.52 C23.1
N$49
  Top 1.778: C22.1 216.92,46.37 214.73,44.18 213.43,42.68 D9.C
  Top 2.184: 7.IN 207.28,22.72 205,25 205,39.5 208,42.5 210.25,42.5 D9.C
N$50  (via drill 0.6)
  Top 0.61: v222,46.5 222,45.5 223,44.5 223,40 222,39.5 C19.2
  Top 1.778: JP4.8 JP4.7 215.66,25.21 213.21,27.67 210.82,27.67 7.OUT
  Top 1.93: 8.IN 210.74,27.85 7.OUT | C19.2 222.37,37.63 225,35 225,27.5 222.5,25 219.79,25 JP4.8
  Bottom 0.61: v222,46.5 222,49 218.5,52.5 204,52.5 203,51.5 R11.1
N$51  (via drill 0.6)
  Top 0.406: v213,45 213,52 212.5,52.5 196.5,52.5 195.5,51.5 R10.1 | 213,38.85 v213,41
  Top 1.27: C21.1 217.04,36.79 218.8,35.04 221.08,35.04 222.61,33.51 222.61,28.43 221.85,27.67 219.66,27.67 JP4.6 JP4.5
  Top 1.778: C21.1 215.19,38.88 214.23,38.85 213,38.85 211.65,39.24 8.OUT
  Bottom 0.406: v213,41 v213,45
N$52
  Top 1.778: LED10.A 195.27,45.95 R10.2
N$53
  Top 1.778: LED11.A R11.2
N$54
  Top 1.778: LED12.K 210.38,45.95 R12.2
N$55  (via drill 0.6)
  Top 0.61: R18.1 276.5,51 278,52.5 287,52.5 287.5,52 287.5,49.5 291,45.6 291,41.7 v291.1,39.2 | v291.1,24.6 291.2,20.3 291.2,16.7 289.1,15 JP6.16
  Top 1.778: 15.OUT 276.55,16.33 279.07,15.33 281.1,14.9 JP6.15 JP6.16 285.75,14.78 C30.2
  Bottom 0.61: v291.1,24.6 v291.1,39.2
N$56  (via drill 0.6)
  Top 0.61: v237.7,50.1 239,50.5 243,50.5 R15.1 | v237.5,46 237.5,42 236.5,41 236.5,24 244,16.5 12.OUT
  Top 1.778: C25.2 249.93,14.85 JP5.15 | JP5.15 JP5.16 | 12.OUT 246.69,16.04 247.5,15.22 247.5,14.97 247.75,14.72 249.8,14.72 JP5.15
  Bottom 0.61: v237.7,50.1 237.5,49 v237.5,46
N$57
  Top 1.778: C28.1 246.36,6.47 D12.A 239.94,11.47 241.91,13.45 243.51,13.45 12.IN
N$58
  Top 1.778: C27.1 249.94,46.37 247.5,43.93 246.81,42.43 D11.C 238.41,40.49 238.36,32.94 238.36,24.37 240.08,22.64 10.IN
N$59  (via drill 0.6)
  Top 0.61: v247.5,46.5 247.5,48.5 243.8,52.5 237.5,52.5 236,51 R14.1 | v254.1,45 256.5,42 256.5,38 256.16,37.55
  Top 1.778: 10.OUT 245.67,27.72 248.01,25.38 249.81,25.38 JP5.7 JP5.8 256.9,25.13 258.17,26.4 258.17,36.05 256.16,37.55 C24.2
  Top 1.93: 10.OUT 243.71,33.61 11.IN
  Bottom 0.61: v254.1,45 252,45.5 248.5,45.5 v247.5,46.5
N$60  (via drill 0.6)
  Top 0.406: v255,49.6 255,51 253.5,52.5 247,52.5 v246.1,52 | v255,46.4 255,45 257.5,42.5 257.5,39 v258.5,38 | 255.07,34.57 v256,35.5
  Top 1.27: JP5.5 254.62,27.68 255.63,28.69 255.63,34.02 255.07,34.57 254.87,34.78 251.06,34.78 250.29,35.54 250.29,37.32 C26.1 247.53,39.05 246.23,39.24 243.56,39.24 11.OUT
  Top 1.778: JP5.6 JP5.5
  Bottom 0.406: v255,46.4 v255,49.6 | v256,35.5 v258.5,38 | v246.1,52 245,52.5 230,52.5 228.5,51 R13.1
N$61
  Top 1.778: LED13.A R13.2
N$62
  Top 1.778: LED14.A 235.47,45.38 R14.2
N$63
  Top 1.778: LED15.K 243.15,45.63 R15.2
N$64
  Top 1.778: C33.1 279.38,6.39 D14.A 272.9,7.45 272.9,12.43 273.89,13.42 15.IN
N$65
  Top 1.27: D13.C 272.9,41.97 272.9,38.34 271.38,36.81 271.38,24.62 273.43,22.56 13.IN
  Top 1.778: D13.C 280.81,43.5 C32.1
N$66  (via drill 0.6)
  Top 0.406: 290.43,37.58 290,38 290,45.5 v284.5,51
  Top 1.778: JP6.8 JP6.7 281.6,25.06 280.01,26.65 280.01,27.16 279.76,27.42 276.96,27.42 13.OUT | JP6.8 286.04,25.06 286.11,25.13 | 286.11,25.13 285.69,25.13 JP6.8 | 286.11,25.13 288.9,25.13 291.57,28.59 291.57,35.44 290.43,37.58 287.04,37.58 C29.2
  Top 1.93: 14.IN 276.78,27.7 13.OUT
  Bottom 0.406: v284.5,51 283,52.5 270.5,52.5 269,51 R17.1
N$67  (via drill 0.6)
  Top 0.61: R16.1 262,50.5 264.8,50.5 267.3,52.5 271.5,52.5 v279.1,46.6 | 279,38.85 v279,41
  Top 1.27: JP6.5 288.07,27.6 289.66,29.19 289.66,33.51 288.14,35.04 284.58,35.04 280.82,36.3 280.82,40.49 C31.1
  Top 1.778: JP6.5 JP6.6 | C31.1 282.38,41.73 280.27,38.85 279,38.85 276.81,38.85 14.OUT
  Bottom 0.61: v279,41 v279.1,46.6
N$68
  Top 1.778: LED16.A R16.2
N$69
  Top 1.778: LED17.A R17.2
N$70
  Top 1.778: LED18.K R18.2
NEGVIN
  Bottom 2.184: DC_IO.1 13.2,4.2 16,7 16,11 18,13 20.62,13 IC1.2 25.46,15.54 30.3,11.1 30.3,4.82 T1.2
  pour Bottom: -3,56 12,56 14,54 14,-1 -1,-1 -3,1

### Text on the board
tNames: - | + | + | - | - | +